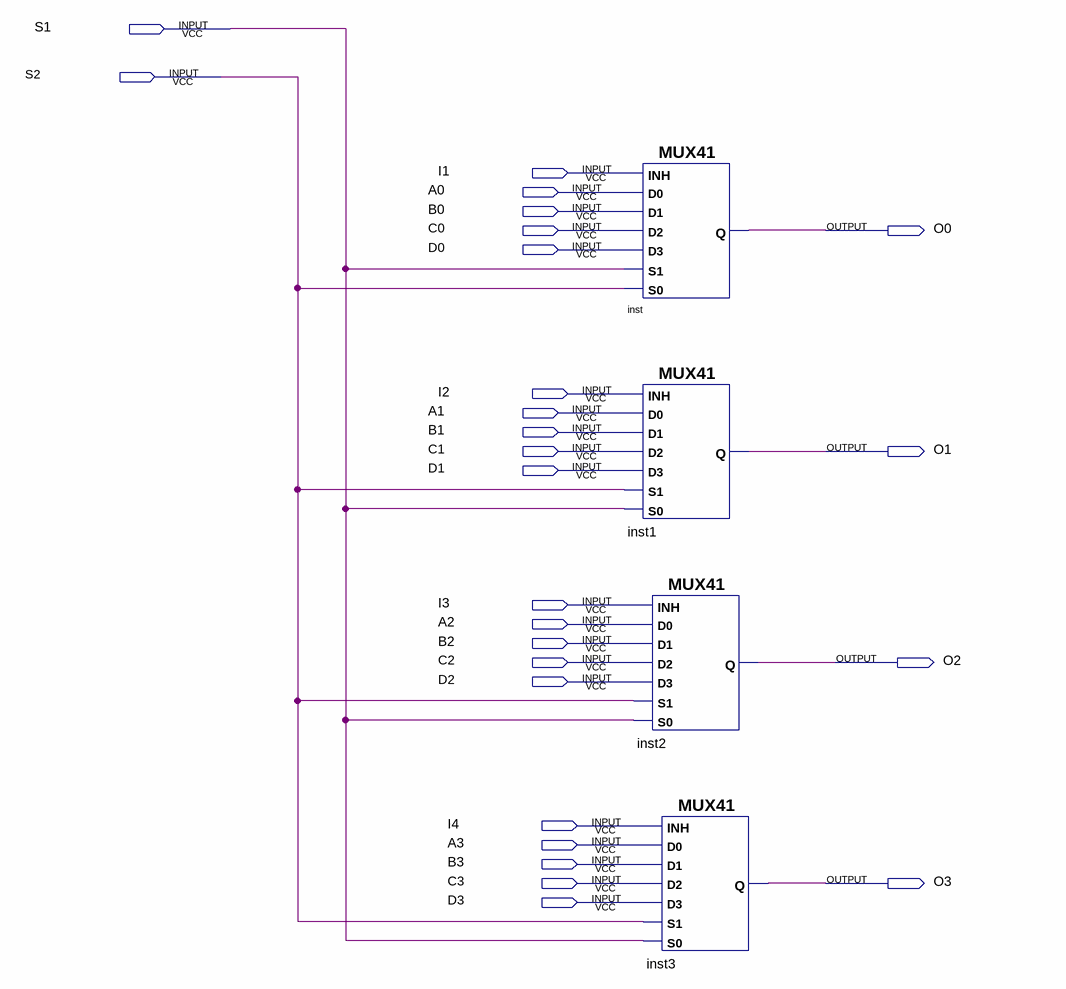
[diagram p0: schematic sheet]
// Quartus schematic Multiplexer.bdf as structural Verilog: 4 symbols, 26 pins
module Multiplexer (
  input  S1,
  input  S2,
  input  I1,
  input  A0,
  input  B0,
  input  C0,
  input  D0,
  input  I2,
  input  A1,
  input  B1,
  input  C1,
  input  D1,
  input  I3,
  input  A2,
  input  B2,
  input  C2,
  input  D2,
  input  I4,
  input  A3,
  input  B3,
  input  C3,
  input  D3,
  output O0,
  output O1,
  output O2,
  output O3
);

  MUX41 inst (.S0(S2), .D2(C0), .S1(S1), .D3(D0), .D0(A0), .D1(B0), .Q(O0));  // open: INH
  MUX41 inst1 (.S0(S1), .D2(C1), .S1(S2), .D3(D1), .D0(A1), .D1(B1), .Q(O1));  // open: INH
  MUX41 inst2 (.S0(S1), .D2(C2), .S1(S2), .D3(D2), .D0(A2), .INH(I3), .D1(B2), .Q(O2));
  MUX41 inst3 (.S0(S1), .D2(C3), .S1(S2), .D3(D3), .D0(A3), .INH(I4), .D1(B3), .Q(O3));
endmodule
